# EAGLE design Main (EAGLE 9.6.2)
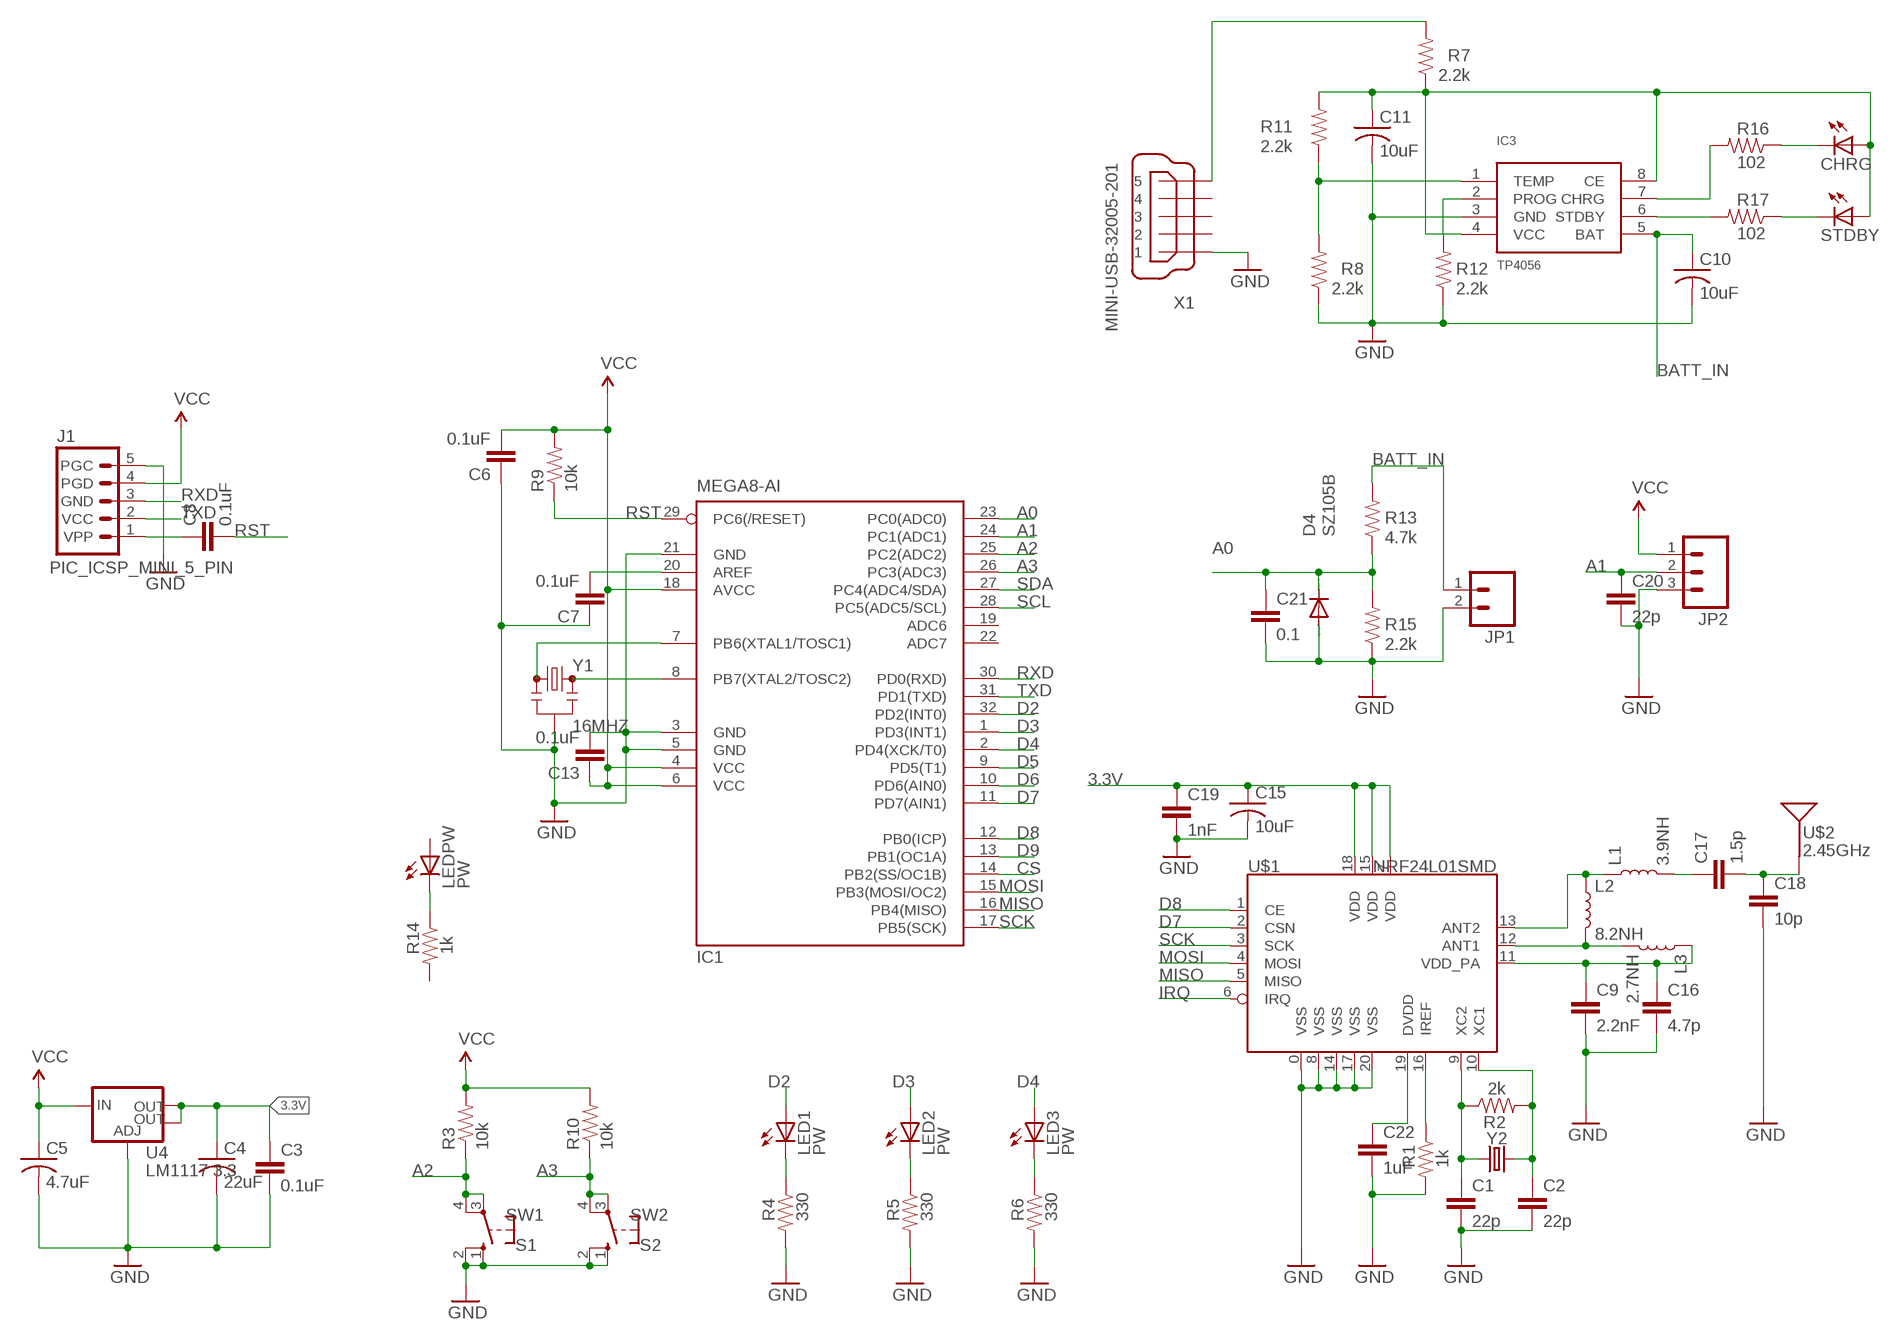
[diagram p0: schematic, sheet 1]

## Parts
C1  22p  CAP0805  [0805]
C2  22p  CAP0805  [0805]
C3  0.1uF  CAP0805  [0805]
C4  22uF  C-USC1206  [C1206]
C5  4.7uF  C-USC1206  [C1206]
C6  0.1uF  CAP0805  [0805]
C7  0.1uF  CAP0805  [0805]
C8  0.1uF  CAP0805  [0805]
C9  2.2nF  CAP0805  [0805]
C10  10uF  C-USC1206  [C1206]
C11  10uF  C-USC1206  [C1206]
C13  0.1uF  CAP0805  [0805]
C15  10uF  C-USC1206  [C1206]
C16  4.7p  CAP0805  [0805]
C17  1.5p  CAP0805  [0805]
C18  10p  CAP0805  [0805]
C19  1nF  CAP0805  [0805]
C20  22p  CAP0805  [0805]
C21  0.1  CAP0805  [0805]
C22  1uF  CAP0805  [0805]
CHRG  PW  LED3MM  [LED3MM]
D4  SZ105B  DIODE-DO-214AC  [DO-214AC]
IC1  MEGA8-AI  [TQFP32-08]
IC3  TP4056  [SOP-8]
J1  PIC_ICSP_MINI_5_PIN  [PIC_ICSP_MINI_5_PIN]
JP1  M02LOCK  [1X02_LOCK]
JP2  M03LOCK  [1X03_LOCK]
L1  3.9NH  INDUCTOR-0402-3.9NH  [0402]
L2  8.2NH  INDUCTOR-0402-3.9NH  [0402]
L3  2.7NH  INDUCTOR-0402-3.9NH  [0402]
LED1  PW  LED3MM  [LED3MM]
LED2  PW  LED3MM  [LED3MM]
LED3  PW  LED3MM  [LED3MM]
LEDPW  PW  LED3MM  [LED3MM]
R1  1k  RESISTOR0805-RES  [0805]
R2  2k  RESISTOR0805-RES  [0805]
R3  10k  RESISTOR0805-RES  [0805]
R4  330  RESISTOR0805-RES  [0805]
R5  330  RESISTOR0805-RES  [0805]
R6  330  RESISTOR0805-RES  [0805]
R7  2.2k  RESISTOR0805-RES  [0805]
R8  2.2k  RESISTOR0805-RES  [0805]
R9  10k  RESISTOR0805-RES  [0805]
R10  10k  RESISTOR0805-RES  [0805]
R11  2.2k  RESISTOR0805-RES  [0805]
R12  2.2k  RESISTOR0805-RES  [0805]
R13  4.7k  RESISTOR0805-RES  [0805]
R14  1k  RESISTOR0805-RES  [0805]
R15  2.2k  RESISTOR0805-RES  [0805]
R16  102  RESISTOR0805-RES  [0805]
R17  102  RESISTOR0805-RES  [0805]
S1  SW1  10-XX  [B3F-10XX]
S2  SW2  10-XX  [B3F-10XX]
STDBY  PW  LED3MM  [LED3MM]
U4  LM1117 3.3  V_REG_LM1117SOT223  [SOT223]
U$1  NRF24L01SMD  [QFN20-4X4MM]
U$2  2.45GHz  ANTENNA2.4GHZ-6.5X2.2MM  [ANT-2.4GHZ-6.5X2.2MM]
X1  MINI-USB-32005-201  [32005-201]
Y1  16MHZ  RESONATOR16MHZ  [RESONATOR-SMD]
Y2  CRYSTALSMD-5X3.2-4PAD  [CRYSTAL-SMD-5X3.2-4PAD]

## Nets
3.3V: C3.1 C4.1 C15.1 C19.1 U4.2(OUT) U4.4(OUT) U$1.7(VDD) U$1.15(VDD) U$1.18(VDD)
A0: C21.1 D4.C R13.1 R15.2
A1: C20.1 IC1.24(PC1(ADC1)) JP2.2
A2: IC1.25(PC2(ADC2)) R3.1 S1.3(P) S1.4(P1)
A3: IC1.26(PC3(ADC3)) R10.1 S2.3(P) S2.4(P1)
BATT_IN: C10.1 IC3.5(BAT) JP1.1 R13.2
CS: IC1.14(PB2(SS/OC1B))
D2: IC1.32(PD2(INT0)) LED1.A
D3: IC1.1(PD3(INT1)) LED2.A
D4: IC1.2(PD4(XCK/T0)) LED3.A
D5: IC1.9(PD5(T1))
D6: IC1.10(PD6(AIN0))
D7: IC1.11(PD7(AIN1)) U$1.2(CSN)
D8: IC1.12(PB0(ICP)) U$1.1(CE)
D9: IC1.13(PB1(OC1A))
GND: C1.2 C2.2 C3.2 C4.2 C5.2 C6.1 C7.1 C9.2 C10.2 C11.2 C13.2 C15.2 C16.2 C18.2 C19.2 C20.2 C21.2 C22.2 D4.A IC1.3(GND) IC1.5(GND) IC1.21(GND) IC3.3(GND) J1.5(PGC) JP1.2 JP2.3 R1.2 R4.2 R5.2 R6.2 R8.1 R12.1 R15.1 S1.1(S) S1.2(S1) S2.1(S) S2.2(S1) U4.1(ADJ) U$1.0(VSS) U$1.8(VSS) U$1.14(VSS) U$1.17(VSS) U$1.20(VSS) X1.1 Y1.2
IRQ: U$1.6(IRQ)
MISO: IC1.16(PB4(MISO)) U$1.5(MISO)
MOSI: IC1.15(PB3(MOSI/OC2)) U$1.4(MOSI)
N$1: LED1.K(C) R4.1
N$2: LED2.K(C) R5.1
N$3: LED3.K(C) R6.1
N$4: C17.1 L1.2
N$5: IC1.8(PB7(XTAL2/TOSC2)) Y1.3
N$7: IC1.7(PB6(XTAL1/TOSC1)) Y1.1
N$8: C7.2 IC1.20(AREF)
N$9: C8.1 J1.1(VPP)
N$11: IC1.23(PC0(ADC0))
N$12: LEDPW.K(C) R14.1
N$13: IC3.7(CHRG) R16.2
N$14: L1.1 L2.1 U$1.13(ANT2)
N$15: L2.2 L3.2 U$1.12(ANT1)
N$16: C9.1 C16.1 L3.1 U$1.11(VDD_PA)
N$17: C22.1 U$1.19(DVDD)
N$18: R1.1 U$1.16(IREF)
N$19: C17.2 C18.1 U$2.FEED(SIGNAL)
N$20: C1.1 R2.1 U$1.9(XC2) Y2.1
N$21: C2.1 R2.2 U$1.10(XC1) Y2.3
N$22: IC3.6(STDBY) R17.2
N$23: R17.1 STDBY.K(C)
N$24: CHRG.K(C) R16.1
N$25: C11.1 CHRG.A IC3.4(VCC) IC3.8(CE) R7.1 R11.2 STDBY.A
N$27: IC3.2(PROG) R12.2
N$29: IC3.1(TEMP) R8.2 R11.1
N$30: R7.2 X1.5
RST: C8.2 IC1.29(PC6(/RESET)) R9.1
RXD: IC1.30(PD0(RXD)) J1.3(GND)
SCK: IC1.17(PB5(SCK)) U$1.3(SCK)
SCL: IC1.28(PC5(ADC5/SCL))
SDA: IC1.27(PC4(ADC4/SDA))
TXD: IC1.31(PD1(TXD)) J1.2(VCC)
VCC: C5.1 C6.2 C13.1 IC1.4(VCC) IC1.6(VCC) IC1.18(AVCC) J1.4(PGD) JP2.1 R3.2 R9.2 R10.2 U4.3(IN)
Unconnected: IC1.19(ADC6) IC1.22(ADC7) LEDPW.A R14.2 X1.2 X1.3 X1.4

## Library data of the parts
C1-C3 C6-C9 C13 C16-C22 = SparkFun-Passives:CAP: Capacitor Standard 0603 ceramic capacitor, and 0.1" leaded capacitor.
C4 C5 C10 C11 C15 = adafruit:C-US: CAPACITOR, American symbol
CHRG LED1-LED3 LEDPW STDBY = adafruit:LED: LED OSRAM: - CHIPLED LG R971, LG N971, LY N971, LG Q971, LY Q971, LO R971, LY R971 LH N974, LH R974 LS Q976, LO Q976, LY Q976 LO Q996 - Hyper CHIPLED LW Q18S LB Q993, LB Q99A, LB R99A - SideLED LS A670, LO A670, LY A670, LG A670, LP A670 LB A673, LV A673, LT A673, LW A673 LH A674 LY A675 LS A676, LA A676, LO A676, LY A676, LW A676 LS A679, LY A679, LG A679 - Hyper Micro SIDELED® LS Y876, LA Y876, LO Y876, LY Y876 LT Y87S - SmartLED LW L88C, LW L88S LB L89C, LB L89S, LG L890 LS L89K, LO L89K, LY L89K LS L896, LA L896, LO L896, LY L896 - TOPLED LS T670, LO T670, LY T670, LG T670, LP T670 LSG T670, LSP T670, LSY T670, LOP T670, LYG T670 LG T671, LOG T671, LSG T671 LB T673, LV T673, LT T673, LW T673 LH T674 LS T676, LA T676, LO T676, LY T676, LB T676, LH T676, LSB T676, LW T676 LB T67C, LV T67C, LT T67C, LS T67K, LO T67K, LY T67K, LW E67C LS E67B, LA E67B, LO E67B, LY E67B, LB E67C, LV E67C, LT E67C LW T67C LS T679, LY T679, LG T679 LS T770, LO T770, LY T770, LG T770, LP T770 LB T773, LV T773, LT T773, LW T773 LH T774 LS E675, LA E675, LY E675, LS T675 LS T776, LA T776, LO T776, LY T776, LB T776 LHGB T686 LT T68C, LB T68C - Hyper Mini TOPLED® LB M676 - Mini TOPLED Santana® LG M470 LS M47K, LO M47K, LY M47K Source: http://www.osram.convergy.de/
D4 = diode:DIODE-: DIODE
IC1 = atmel:MEGA8: MICROCONTROLLER 8 Kbytes FLASH, 1 kbytes SRAM, 512 bytes EEPROM, USART, 6-channel 10 bit ADC, 2-channel 8 bit ADC Pin compatible with Atmega48, ATMega88, ATMega168 Source: avr.lbr; MPN: ATMEGA8-16AU; OC_FARNELL: 9171371; OC_NEWARK: 73M8863
IC3 = TP4056:TP4056
J1 = SparkFun-Connectors:PIC_ICSP_MINI_5_PIN: PIC-ICSP-Mini Miniature 5-pin connection for temporary programming of PICs. Use this device in your design to save space. Miniature ISCP Programming connector for PICs This 5 pin header contains all the lines necessary for programming most PIC microcontrollers. Use this device in your design to save space. Here is the connector we sell at SparkFun: 5-Pin Mini ICSP Connector <https://www.sparkfun.com/products/11264> (PRT-11264) It is used on these SparkFun products: USB Bit Whacker - 18F2553 Development Board <https://www.sparkfun.com/products/762> (DEV-00762) SparkFun Serial Enabled LCD Backpack <https://www.sparkfun.com/products/258> (LCD-00258) Also, if you need a nice PIC programmer, please check these out: MPLAB PICkit 3 <https://www.sparkfun.com/products/9973> (PGM-09973); PROD_ID: CONN-08314; SF_ID: PRT-11264
JP1 = SparkFun:M02: Header 2 Standard 2-pin 0.1" header. Use with straight break away headers (SKU : PRT-00116), right angle break away headers (PRT-00553), swiss pins (PRT-00743), machine pins (PRT-00117), and female headers (PRT-00115). Molex polarized connector foot print use with SKU : PRT-08233 with associated crimp pins and housings.
JP2 = SparkFun:M03: Header 3 Standard 3-pin 0.1" header. Use with straight break away headers (SKU : PRT-00116), right angle break away headers (PRT-00553), swiss pins (PRT-00743), machine pins (PRT-00117), and female headers (PRT-00115). Molex polarized connector foot print use with SKU : PRT-08232 with associated crimp pins and housings.
L1 = SparkFun-Coils:INDUCTOR: Inductors Resist changes in electrical current. Basically a coil of wire. SparkFun Products: SparkFun Load Cell Amplifier - HX711 <https://www.sparkfun.com/products/13879> IOIO-OTG - V2.2 <https://www.sparkfun.com/products/13613>; PROD_ID: NDUC-13457
L2 L3 = SparkFun-Coils:INDUCTOR: Inductors Resist changes in electrical current. Basically a coil of wire. SparkFun Products: SparkFun Load Cell Amplifier - HX711 <https://www.sparkfun.com/products/13879> IOIO-OTG - V2.2 <https://www.sparkfun.com/products/13613>; PROD_ID: NDUC-13457; VALUE: 3.9NH
R1-R17 = SparkFun-Resistors:RESISTOR: Resistor Basic schematic elements and footprints for 0603, 1206, and PTH resistors.
S1 S2 = switch-omron:10-XX: OMRON SWITCH; MPN: B3F-1000; OC_FARNELL: 176432; OC_NEWARK: 36M3542
U4 = SparkFun-PowerIC:V_REG_LM1117: Voltage Regulator LM1117 Standard adjustable voltage regulator but in SMD form. Spark Fun Electronics SKU : COM-00595; PROD_ID: VREG-08170
U$1 = SparkFun-RF:NRF24L01: Nordic nrf24L01 2.4GHz Low-power Transceiver This is the very popular, low cost, very low power RF transceiver from Nordic Semiconductor. Simple SPI interface. SparkFun Products 2.4GHz Transceiver IC - nRF24L01+ <https://www.sparkfun.com/products/690> (COM-00690) SparkFun Transceiver Breakout - nRF24L01+ (RP-SMA) <https://www.sparkfun.com/products/705> (WRL-00705) SparkFun Transceiver Breakout - nRF24L01+ <https://www.sparkfun.com/products/691> (COM-00691); PROD_ID: IC-08950; SF_ID: COM-00690
U$2 = SparkFun-RF:ANTENNA: Single-ended Antennae 2.4GHz and antennae with just one terminal. These are all chip antennae. 2.4GHz (WiFi/BT/ZigBee) Antennae ANT-2.4GHZ-6.5X2.2MM - 6.5 x 2.2 mm chip antenna. (SparkFun Product <https://www.sparkfun.com/products/144>) ANT-2.4GHZ8.0X1.0MM - 8.0 x 1.0 mm chip antenna. (Datasheet <http://www.mouser.com/ds/2/611/antenna_2500at44m0400-242425.pdf>) ANT-2.4GHZ9.5X2.0MM - 9.5 x 2.0 mm chip antenna. (SparkFun Product <https://www.sparkfun.com/products/9025>); PROD_ID: ANT-08187; SF_ID: WRL-00144
X1 = con-cypressindustries:MINI-USB-: MINI USB-B Conector Source: www.cypressindustries.com; OC_FARNELL: unknown; OC_NEWARK: unknown
Y1 = SparkFun-FreqCtrl:RESONATOR: Resonator Small SMD resonator. Used, eg, on the Arduino Pro/ Pro Mini boards. 8MHz- XTAL-08895 16MHz- XTAL-08900; PROD_ID: XTAL-08900
Y2 = SparkFun-Clocks:CRYSTAL: Crystals (Generic) These are passive quartz crystals, which can be used as a clock source for a microcontroller. Crystal's are two-terminal devices. They require external "load" capacitors to generate an oscillating signal.

## Net classes
1 power: width 0.203 mm

## Board
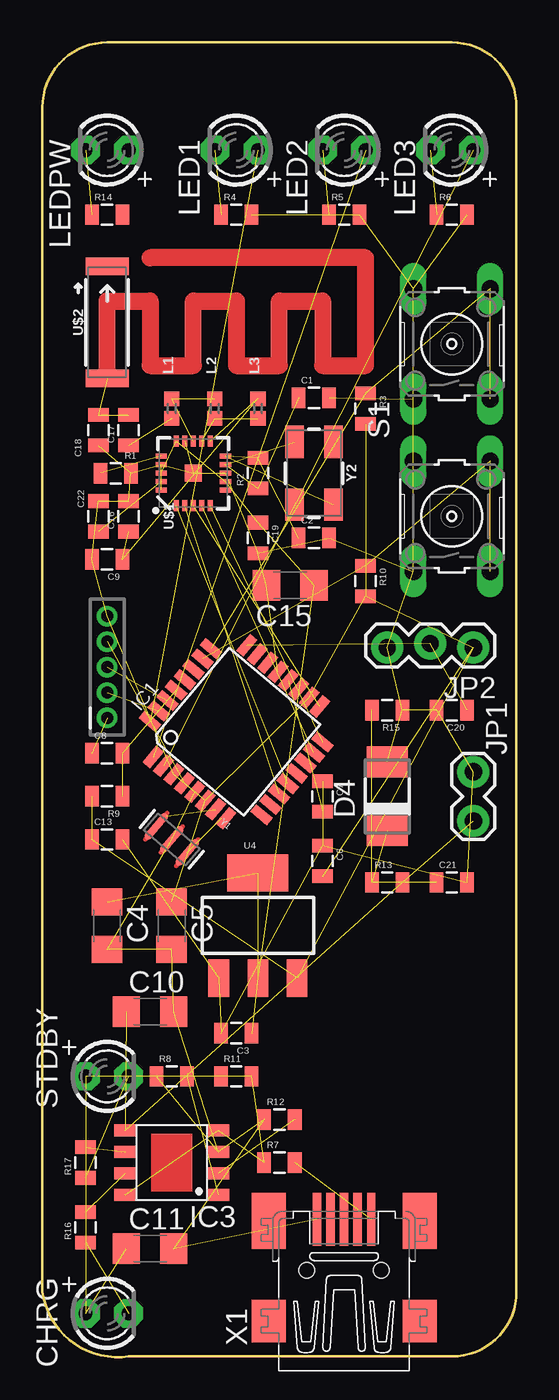
[diagram p1: board, top side]
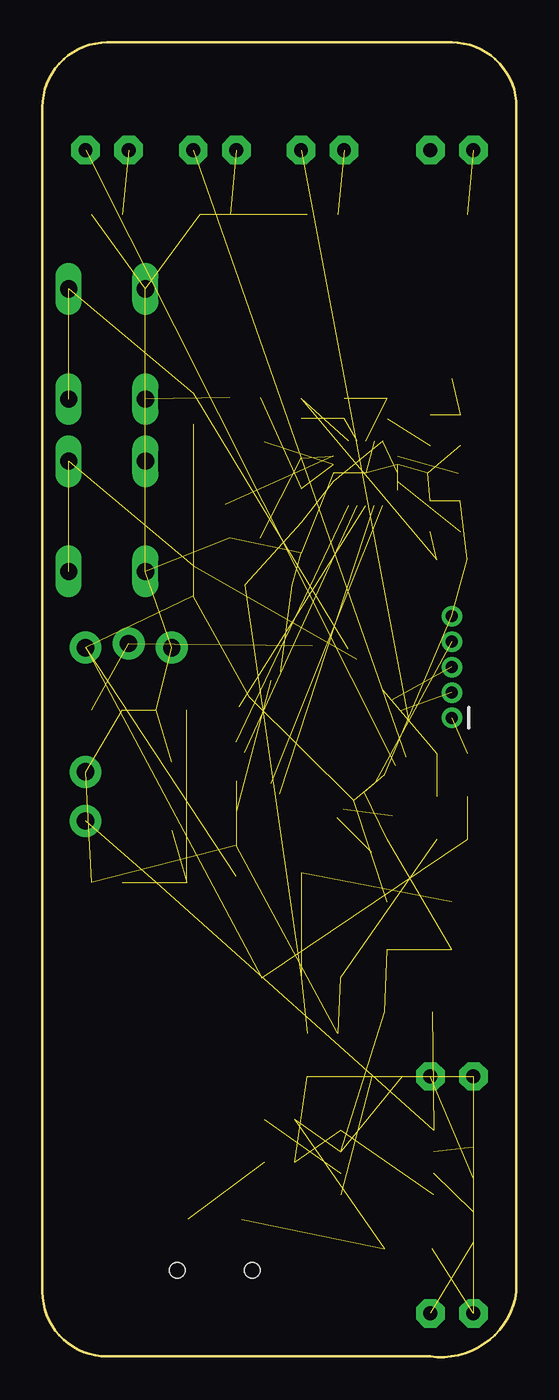
[diagram p2: board, bottom side, seen from below]

Size 27.94 x 77.51 mm. Coordinates in mm from the lower left corner, seen from the top.
Outline: 0,73.7 0,3.85 arc90 5.08,0.04 24.13,0.04 arc90 27.94,3.85 27.94,73.7 arc90 24.13,77.51 3.81,77.51 arc90 0,73.7
Copper layers (1*16): Top 0.035mm / dielectric 1.5mm / Bottom 0.035mm
Design rules "default": minimum track width 6mil, minimum drill 0.35mm, track to track 6mil, track to pad 6mil, pad to pad 6mil, via to via 6mil, smd to smd 6mil, copper to edge 40mil, drill to drill 6mil, minimum pad ring 10mil, minimum via ring 8mil, stop-mask expansion 4mil, vias tented up to drill 0mil, thermal gap 10mil

### Footprints (pad centres in the part's own frame; a part is rotated, then mirrored left to right if it is on the bottom)
0805 = smd 0.8 x 1.2: 1 -0.9,0; 2 0.9,0
C1206 = smd 1.6 x 1.8: 1 -1.4,0; 2 1.4,0
LED3MM = drill 0.813 pad 1.676 octagon: A -1.27,0; K 1.27,0
DO-214AC = smd 1.8 x 2.4: A 2.025,0; C -2.025,0
TQFP32-08 = smd 1.27 x 0.559: 1 -4.293,2.8; 2 -4.293,2; 3 -4.293,1.2; 4 -4.293,0.4; 5 -4.293,-0.4; 6 -4.293,-1.2; 7 -4.293,-2; 8 -4.293,-2.8; 17 4.293,-2.8; 18 4.293,-2; 19 4.293,-1.2; 20 4.293,-0.4; 21 4.293,0.4; 22 4.293,1.2; 23 4.293,2; 24 4.293,2.8 | smd 0.559 x 1.27: 9 -2.8,-4.293; 10 -2,-4.293; 11 -1.2,-4.293; 12 -0.4,-4.293; 13 0.4,-4.293; 14 1.2,-4.293; 15 2,-4.293; 16 2.8,-4.293; 25 2.8,4.293; 26 2,4.293; 27 1.2,4.293; 28 0.4,4.293; 29 -0.4,4.293; 30 -1.2,4.293; 31 -2,4.293; 32 -2.8,4.293
SOP-8 = smd 1.3 x 0.7: 1 -2.75,1.905; 2 -2.75,0.635; 3 -2.75,-0.635; 4 -2.75,-1.905; 5 2.75,-1.905; 6 2.75,-0.635; 7 2.75,0.635; 8 2.75,1.905
PIC_ICSP_MINI_5_PIN = drill 0.7: 1 -3,0; 2 -1.5,0; 3 0,0; 4 1.5,0; 5 3,0
1X02_LOCK = drill 1.016 pad 1.88: 1 -0.178,0; 2 2.718,0
1X03_LOCK = drill 1.016 pad 1.88: 1 0,0.127; 2 2.54,-0.127; 3 5.08,0.127
0402 = smd 0.85 x 0.9: 1 -0.58,0; 2 0.58,0
B3F-10XX = drill 1.016 long: 1 -3.251,2.261; 2 3.251,2.261; 3 -3.251,-2.261; 4 3.251,-2.261
SOT223 = smd 1.219 x 2.235: 1 -2.311,-3.099; 2 0,-3.099; 3 2.311,-3.099 | smd 3.6 x 2.2: 4 0,3.099
QFN20-4X4MM = smd 1 x 1: 0 0,0 | smd 0.65 x 0.3: 1 -1.9,1; 2 -1.9,0.5; 3 -1.9,0; 4 -1.9,-0.5; 5 -1.9,-1; 11 1.9,-1; 12 1.9,-0.5; 13 1.9,0; 14 1.9,0.5; 15 1.9,1 | smd 0.3 x 0.65: 6 -1,-1.9; 7 -0.5,-1.9; 8 0,-1.9; 9 0.5,-1.9; 10 1,-1.9; 16 1,1.9; 17 0.5,1.9; 18 0,1.9; 19 -0.5,1.9; 20 -1,1.9
ANT-2.4GHZ-6.5X2.2MM = smd 1.016 x 2.54: FEED -3.302,0; NC 3.302,0
32005-201 = smd 3.1 x 0.5: 1 3,1.6; 2 3,0.8; 3 3,0; 4 3,-0.8; 5 3,-1.6 | smd 2.5 x 2: M1 -3,-4.45; M2 -3,4.45 | smd 3.3 x 2: M3 2.9,4.45; M4 2.9,-4.45 | hole 0.9: 0,2.2; 0,-2.2
RESONATOR-SMD = smd 0.45 x 1.905: 1 -1.2,0; 2 0,0; 3 1.2,0
CRYSTAL-SMD-5X3.2-4PAD = smd 1.9 x 1.1: 1 -1.85,-1.15; 2 1.85,-1.15; 3 1.85,1.15; 4 -1.85,1.15

### Placement (x,y rotation side)
C1  16,56.56 0 top
C2  16,48.3 0 top
C3  11.43,19.09 180 top
C4  3.81,25.44 270 top
C5  7.62,25.44 270 top
C6  16.51,29.25 270 top
C7  16.51,33.06 270 top
C8  3.81,35.6 0 top
C9  3.81,47.03 180 top
C10  6.35,20.36 0 top
C11  6.35,6.39 0 top
C13  3.81,30.52 0 top
C15  14.61,45.51 180 top
C16  5.08,49.57 90 top
C17  5.08,54.65 90 top
C18  3.3,54.65 270 top
C19  12.7,48.3 270 top
C20  24.13,38.14 180 top
C21  24.13,27.98 0 top
C22  3.3,49.57 90 top
CHRG  3.81,2.58 0 top
D4  20.32,33.06 90 top
IC1  11.43,36.87 50 top
IC3  7.62,11.47 180 top
J1  3.81,40.68 90 top
JP1  25.4,31.79 90 top
JP2  25.4,41.95 180 top
L1  7.62,55.92 270 top
L2  10.16,55.92 270 top
L3  12.7,55.92 270 top
LED1  11.43,71.16 180 top
LED2  17.78,71.16 180 top
LED3  24.13,71.16 180 top
LEDPW  3.81,71.16 180 top
R1  4.32,52.11 0 top
R2  12.7,52.11 90 top
R3  19.05,55.92 270 top
R4  11.43,67.35 0 top
R5  17.78,67.35 0 top
R6  24.13,67.35 0 top
R7  13.97,11.47 0 top
R8  7.62,16.55 0 top
R9  3.81,33.06 180 top
R10  19.05,45.76 270 top
R11  11.43,16.55 0 top
R12  13.97,14.01 0 top
R13  20.32,27.98 0 top
R14  3.81,67.35 0 top
R15  20.32,38.14 180 top
R16  2.54,7.66 90 top
R17  2.54,11.47 90 top
S1  24.13,59.73 90 top
S2  24.13,49.57 90 top
STDBY  3.81,16.55 0 top
U4  12.7,25.44 0 top
U$1  8.89,52.11 90 top
U$2  3.81,61 90 top
X1  17.78,5.12 90 top
Y1  7.62,30.52 320 top
Y2  16,52.11 270 top

### Tracks (layer width: path | path; a pad name or v marks a point on that pad's centre or on a via)
3.3V  (8 unrouted)
A0  (3 unrouted)
A1  (2 unrouted)
A2  (3 unrouted)
A3  (3 unrouted)
BATT_IN  (3 unrouted)
D2  (1 unrouted)
D3  (1 unrouted)
D4  (1 unrouted)
D7  (1 unrouted)
D8  (1 unrouted)
GND  (44 unrouted)
MISO  (1 unrouted)
MOSI  (1 unrouted)
N$1  (1 unrouted)
N$2  (1 unrouted)
N$3  (1 unrouted)
N$4  (1 unrouted)
N$5  (1 unrouted)
  Top 0.152: IC1.8 10.57,31.78
N$7  (1 unrouted)
  Top 0.152: Y1.1 7.32,31.91
N$8  (1 unrouted)
N$9  (1 unrouted)
N$12  (1 unrouted)
N$13  (1 unrouted)
N$14  (2 unrouted)
N$15  (2 unrouted)
N$16  (3 unrouted)
N$17  (1 unrouted)
N$18  (1 unrouted)
N$19  (2 unrouted)
  Top 1.016: U$2.FEED 3.81,62.27 6.35,62.27 6.35,58.46 8.89,58.46 8.89,62.27 11.43,62.27 11.43,58.46 13.97,58.46 13.97,62.27 16.51,62.27 16.51,58.46 19.05,58.46 19.05,64.81 6.35,64.81
N$20  (3 unrouted)
N$21  (3 unrouted)
N$22  (1 unrouted)
N$23  (1 unrouted)
N$24  (1 unrouted)
N$25  (6 unrouted)
N$27  (1 unrouted)
N$29  (2 unrouted)
N$30  (1 unrouted)
RST  (2 unrouted)
RXD  (1 unrouted)
SCK  (1 unrouted)
TXD  (1 unrouted)
VCC  (11 unrouted)